# Altium schematic sheet Memory.SchDoc
size B; SheetNumber: 2; SheetTotal: 15
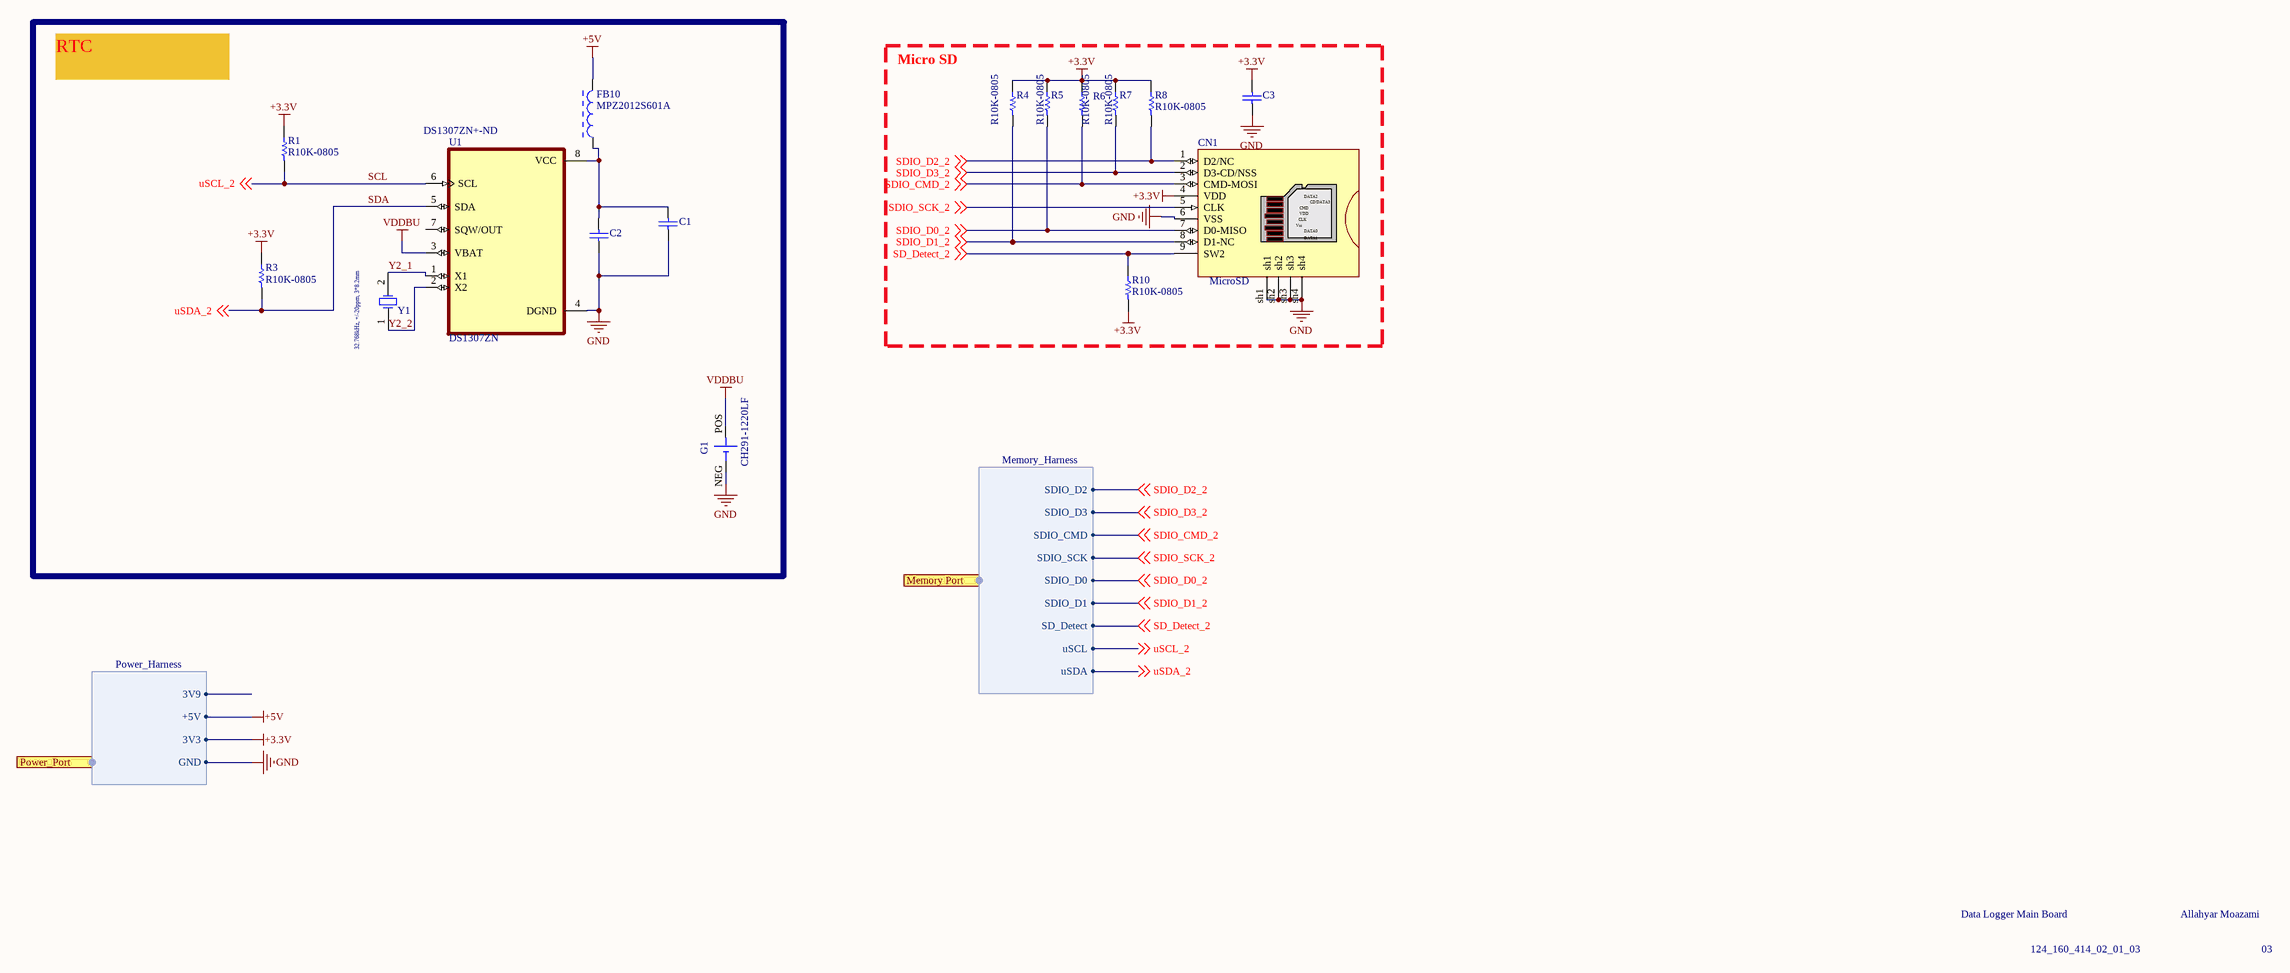
[diagram p0: Memory.SchDoc]

## Parts
C1  (no value)  [CRF06031]
C2  C100nF-0805  [CRF06031]  (value not drawn)
C3  (no value)  [CRF06031]
CN1  MicroSD  [MicroSD]
FB10  MPZ2012S601A  [TDK-MPZ2012_V]
G1  CH291-1220LF  [*CH291-1220LF_CH291-1220LF(Primary)]
R1  R10K-0805  [CRF06031]
R3  R10K-0805  [CRF06031]
R4  R10K-0805  [CRF06031]
R5  R10K-0805  [CRF06031]
R6  R10K-0805  [CRF06031]
R7  R10K-0805  [CRF06031]
R8  R10K-0805  [CRF06031]
R10  R10K-0805  [CRF06031]
U1  DS1307ZN  Supplier Part Number 1: DS1307ZN+-ND  [SOIC127P600X175-8N]
Y1  32.768kHz, +/-20ppm, 3*8.2mm  [WE-XTAL_WATCH_3x8.2]

## Blocks framed on the sheet
Micro SD: C3 CN1 R4-R8 R10

## Ports
Memory Port (harness Memory_Harness), Power_Port (harness Power_Harness)

## Harnesses
Memory_Harness: SDIO_D3, SDIO_CMD, SDIO_SCK, SDIO_D0, SDIO_D1, SD_Detect, uSCL, SDIO_D2, uSDA
Power_Harness: 3V9, +5V, 3V3, GND

## Nets
+3.3V: C3.2 CN1.4(VDD) R1.1 R3.1 R4.1 R5.1 R6.1 R7.1 R8.1 R10.2 ; port Power_Port.3V3
+5V: FB10.2 ; port Power_Port.+5V
GND: C1.1 C2.1 C3.1 CN1.6(VSS) CN1.sh1 CN1.sh2 CN1.sh3 CN1.sh4 G1.NEG U1.4(DGND) ; port Power_Port.GND
VDDBU: G1.POS U1.3(VBAT)
SCL: R1.2 U1.6(SCL) ; off-sheet uSCL_2, port Memory Port.uSCL  [also labelled uSCL_2]
SD_Detect_2: CN1.9(SW2) R10.1 ; off-sheet SD_Detect_2, port Memory Port.SD_Detect
SDA: R3.2 U1.5(SDA) ; off-sheet uSDA_2, port Memory Port.uSDA  [also labelled uSDA_2]
SDIO_CMD_2: CN1.3(CMD-MOSI) R6.2 ; off-sheet SDIO_CMD_2, port Memory Port.SDIO_CMD
SDIO_D0_2: CN1.7(D0-MISO) R5.2 ; off-sheet SDIO_D0_2, port Memory Port.SDIO_D0
SDIO_D1_2: CN1.8(D1-NC) R4.2 ; off-sheet SDIO_D1_2, port Memory Port.SDIO_D1
SDIO_D2_2: CN1.1(D2/NC) R8.2 ; off-sheet SDIO_D2_2, port Memory Port.SDIO_D2
SDIO_D3_2: CN1.2(D3-CD/NSS) R7.2 ; off-sheet SDIO_D3_2, port Memory Port.SDIO_D3
SDIO_SCK_2: CN1.5(CLK) ; off-sheet SDIO_SCK_2, port Memory Port.SDIO_SCK
Y2_1: U1.1(X1) Y1.2(OSC2)
Y2_2: U1.2(X2) Y1.1(OSC1)
NetC1_2: C1.2 C2.2 FB10.1 U1.8(VCC)

Not connected (* = marked no-connect by the designer): U1 7(SQW/OUT)

## Notes on the sheet
- RTC
- Data Logger Main Board
- Allahyar Moazami
- 124_160_414_02_01_03
- 03
- (in symbol MicroSD) DATA2; CD/DATA3; CMD; Vss; DATA0; DATA1

## Library data of the parts
C1-C3 = Cap: Capacitor; Manufacturer_P/N: GCM21BR72A104KA37L; Digi-Key_Part_Number: 490-4789-1-ND; JLC P/N: C85866
  C1 C2: ClassName: RTC
  C3: ClassName: SD
CN1 = MicroSD: MicroSD,9 pin; Manufacturer_P/N: MSD-4-A; Digi-Key_Part_Number: 2223-MSD-4-ATR-ND; ClassName: SD; JLC P/N: C22367949
FB10 = CMP-2000-05400-1: Chip Bead for Power Line, 600 Ohm, +/- 25%, 2 A, -55 to 125 degC, 2-Pin SMD (0805), RoHS, Tape and Reel; Manufacturer_P/N: MPZ2012S601AT000; Maximum DC Current: 2A; Maximum DC Resistance: 100mOhms; Manufacturer URL: http://www.tdk.com/; Product: FerriteChipBeads; Digi-Key_Part_Number: 445-MPZ2012S601AT000TR-ND; ClassName: RTC; JLC P/N: C21519
G1 = CH291-1220LF: BATTERY HOLDER, SMT, 12MM; Accessory Type: Coin Cell Battery Holder; For Use With: 1220 Coin Cell Batteries; Battery ...; Manufacturer_P/N: S8411-45R; MF: Multicomp; MP: CH291-1220LF; ClassName: RTC; Digi-Key_Part_Number: 952-1745-2-ND; JLC P/N: C5199899
R1 R3-R8 R10 = Res1: Resistor; Manufacturer_P/N: RC0805FR-1310KL; Digi-Key_Part_Number: 13-RC0805FR-1310KLTR-ND; JLC P/N: C4121085
  R1 R3: ClassName: RTC
  R4-R8 R10: ClassName: SD
U1 = DS1307ZN: Real Time Clock _RTC_ IC Clock/Calendar 56B IÂ²C, 2-Wire Serial 8-SOIC _0.154, 3.90mm Width_; MP: DS1307ZN+; MF: Maxim Integrated; ClassName: RTC; Digi-Key_Part_Number: DS1307ZN+-ND; Supplier 1: Digikey; Manufacturer_P/N: DS1307ZN+; JLC P/N: C3304433
Y1 = 830002995B: dip; Manufacturer_P/N: ECS-.327-CDX-1038; Part Number: 830002995B; ClassName: RTC; Digi-Key_Part_Number: XC2121-ND; JLC P/N: C2636480